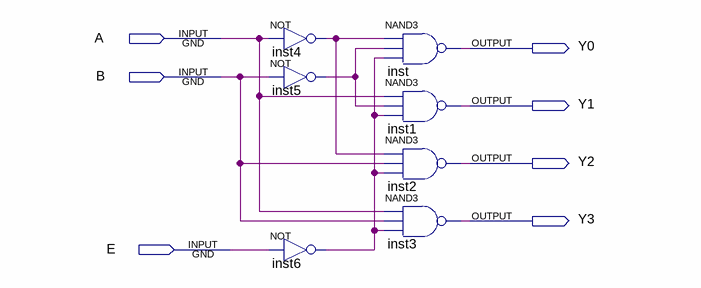
[diagram p0: schematic sheet]
// Quartus schematic 2x4_decoder_E.bdf as structural Verilog: 7 symbols, 7 pins
module \2x4_decoder_E  (
  input  A,
  input  B,
  input  E,
  output Y0,
  output Y1,
  output Y2,
  output Y3
);

  wire inst4_out, inst5_out, inst6_out;

  not inst4 (inst4_out, A);
  not inst5 (inst5_out, B);
  not inst6 (inst6_out, E);
  nand inst (Y0, inst4_out, inst5_out, inst6_out);
  nand inst1 (Y1, A, inst5_out, inst6_out);
  nand inst2 (Y2, inst4_out, B, inst6_out);
  nand inst3 (Y3, A, B, inst6_out);
endmodule
